# EAGLE design team6 (EAGLE 8.6.0)
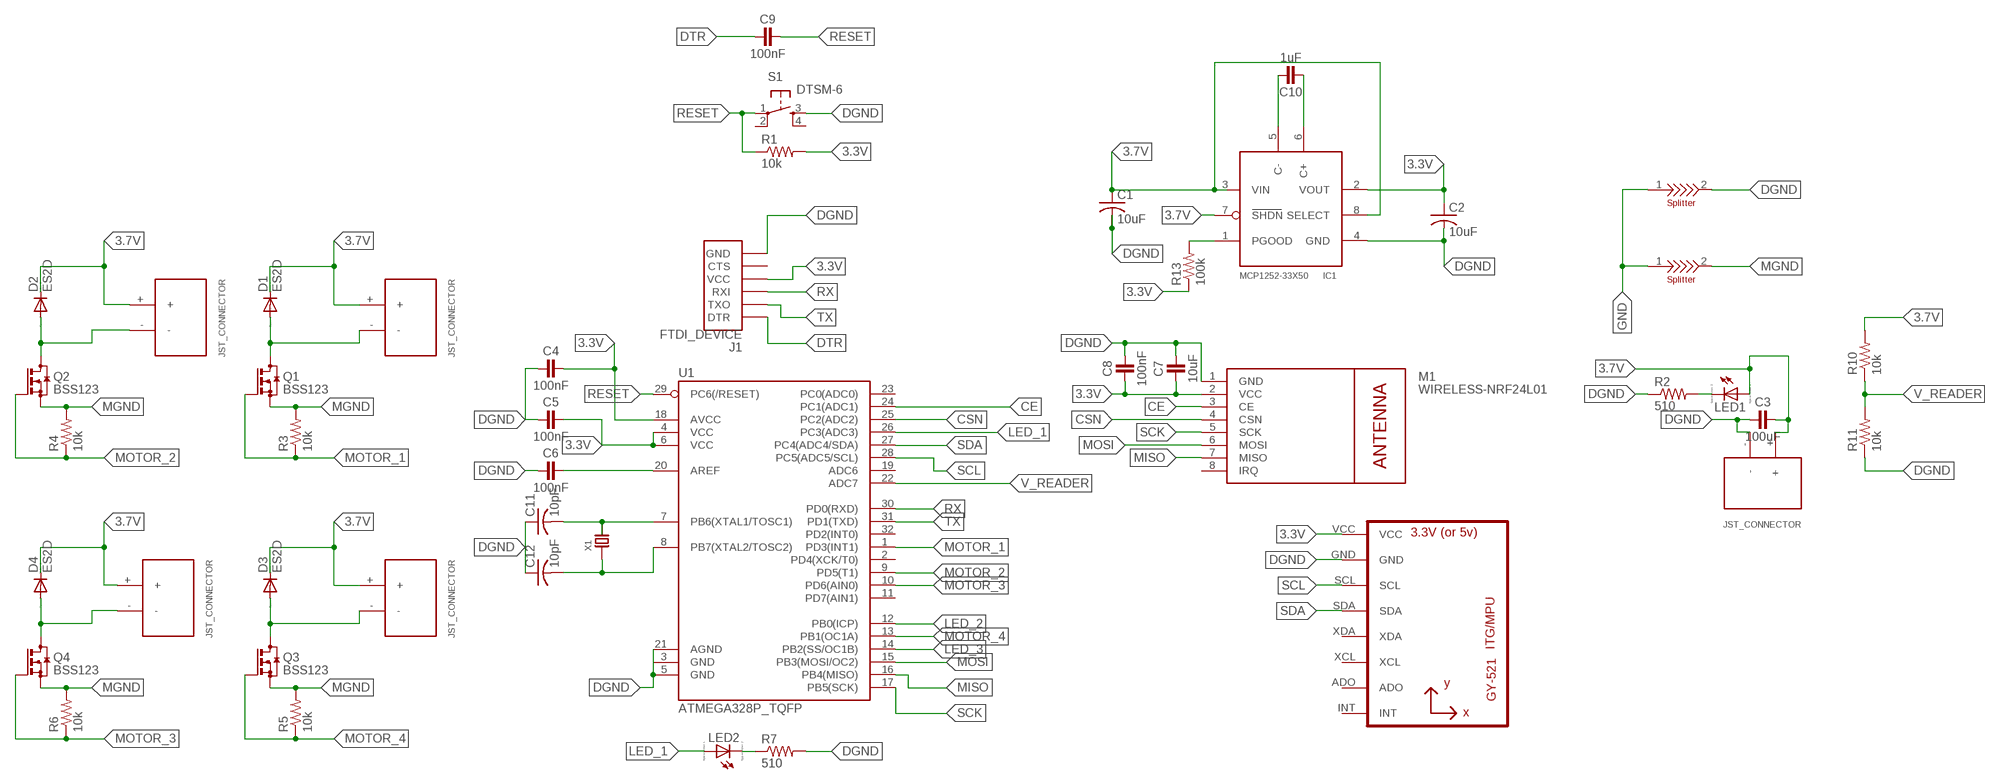
[diagram p0: schematic, sheet 1]

## Parts
C1  10uF  C-USC1206  [C1206]
C2  10uF  C-USC1206  [C1206]
C3  100uF  CAPACITOR-1206  [C1206]
C4  100nF  CAPACITOR-0603  [C0603]
C5  100nF  CAPACITOR-0603  [C0603]
C6  100nF  CAPACITOR-0603  [C0603]
C7  10uF  CAPACITOR-0603  [C0603]
C8  100nF  CAPACITOR-0603  [C0603]
C9  100nF  CAPACITOR-0603  [C0603]
C10  1uF  CAPACITOR-0603  [C0603]
C11  10pF  RCL_C-USC0603K  [RCL_C0603K]
C12  10pF  RCL_C-USC0603K  [RCL_C0603K]
D1  ES2D  [SMB]
D2  ES2D  [SMB]
D3  ES2D  [SMB]
D4  ES2D  [SMB]
IC1  MCP1252-33X50  [MSOP8]
J1  FTDI_DEVICE  [FTDI_DEVICE_SIDE]
JST_MOTOR_1  JST_MOTOR_1  JST_CONNECTOR_FEMALE  [JST_CONNECTOR_FEMALE]
LED1  LED_ESML0603  [LED_SML0603]
LED2  LED_ESML0603  [LED_SML0603]
M1  WIRELESS-NRF24L01  [WIRELESS-NRF24L01]
Q1  BSS123  [SOT23]
Q2  BSS123  [SOT23]
Q3  BSS123  [SOT23]
Q4  BSS123  [SOT23]
R1  10k  10.5KOHM1/10W1%(0603)  [0603]
R2  510  10.5KOHM1/10W1%(0603)  [0603]
R3  10k  10.5KOHM1/10W1%(0603)  [0603]
R4  10k  10.5KOHM1/10W1%(0603)  [0603]
R5  10k  10.5KOHM1/10W1%(0603)  [0603]
R6  10k  10.5KOHM1/10W1%(0603)  [0603]
R7  510  10.5KOHM1/10W1%(0603)  [0603]
R10  10k  10.5KOHM1/10W1%(0603)  [0603]
R11  10k  10.5KOHM1/10W1%(0603)  [0603]
R13  100k  10.5KOHM1/10W1%(0603)  [0603]
S1  DTSM-6  [DTSM-6]
U1  ATMEGA328P_TQFP  [TQFP32-08]
U3  GY-521MPU6050  [GY-521]
U$2  JST_CONNECTOR_FEMALE  [JST_CONNECTOR_FEMALE]
U$3  JST_CONNECTOR_FEMALE  [JST_CONNECTOR_FEMALE]
U$4  JST_CONNECTOR_FEMALE  [JST_CONNECTOR_FEMALE]
U$5  JST_CONNECTOR_FEMALE  [JST_CONNECTOR_FEMALE]
U$7  SPLITTER  [SPLITTER]
U$8  SPLITTER  [SPLITTER]
X1  CRYSTAL-NX3225GD  [NDK-NX3225GD]

## Nets
3.3V: C2.1 C4.2 C5.2 C7.1 C8.1 IC1.2(VOUT) J1.P$4(VCC) M1.2(VCC) R1.2 R13.1 U1.4(VCC) U1.6(VCC) U1.18(AVCC) U3.VCC
3.7V: C1.1 C3.2 D1.C D2.C D3.C D4.C IC1.3(VIN) IC1.7(SHDN) IC1.8(SELECT) JST_MOTOR_1.+ LED1.A R10.2 U$2.+ U$3.+ U$4.+ U$5.+
CE: M1.3(CE) U1.24(PC1(ADC1))
CSN: M1.4(CSN) U1.25(PC2(ADC2))
DGND: C1.2 C2.2 C3.1 C4.1 C5.1 C6.1 C7.2 C8.2 C11.1 C12.1 IC1.4(GND) J1.P$6(GND) M1.1(GND) R2.1 R7.2 R11.1 S1.3 U1.3(GND) U1.5(GND) U1.21(AGND) U3.GND U$2.- U$8.2
DTR: C9.1 J1.P$1(DTR)
GND: U$7.1 U$8.1
LED_1: LED2.A U1.26(PC3(ADC3))
LED_2: U1.12(PB0(ICP))
LED_3: U1.14(PB2(SS/OC1B))
MGND: Q1.2(S) Q2.2(S) Q3.2(S) Q4.2(S) R3.2 R4.2 R5.2 R6.2 U$7.2
MISO: M1.7(MISO) U1.16(PB4(MISO))
MOSI: M1.6(MOSI) U1.15(PB3(MOSI/OC2))
MOTOR_1: Q1.1(G) R3.1 U1.1(PD3(INT1))
MOTOR_2: Q2.1(G) R4.1 U1.9(PD5(T1))
MOTOR_3: Q4.1(G) R6.1 U1.10(PD6(AIN0))
MOTOR_4: Q3.1(G) R5.1 U1.13(PB1(OC1A))
N$1: D2.A Q2.3(D) U$3.-
N$2: D1.A JST_MOTOR_1.- Q1.3(D)
N$3: D3.A Q3.3(D) U$5.-
N$4: D4.A Q4.3(D) U$4.-
N$5: LED1.C R2.2
N$6: C11.2 U1.7(PB6(XTAL1/TOSC1)) X1.2
N$7: C12.2 U1.8(PB7(XTAL2/TOSC2)) X1.1
N$9: C6.2 U1.20(AREF)
N$11: C10.2 IC1.5(C-)
N$12: C10.1 IC1.6(C+)
N$16: LED2.C R7.1
PGOOD: IC1.1(PGOOD) R13.2
RESET: C9.2 R1.1 S1.1 U1.29(PC6(/RESET))
RX: J1.P$3(RXI) U1.30(PD0(RXD))
SCK: M1.5(SCK) U1.17(PB5(SCK))
SCL: U1.28(PC5(ADC5/SCL)) U3.SCL
SDA: U1.27(PC4(ADC4/SDA)) U3.SDA
TX: J1.P$2(TXO) U1.31(PD1(TXD))
V_READER: R10.1 R11.2 U1.22(ADC7)
Unconnected: J1.P$5(CTS) M1.8(IRQ) S1.2 S1.4 U1.2(PD4(XCK/T0)) U1.11(PD7(AIN1)) U1.19(ADC6) U1.23(PC0(ADC0)) U1.32(PD2(INT0)) U3.ADO U3.INT U3.XCL U3.XDA

## Library data of the parts
C1 C2 = resistor:C-US: CAPACITOR, American symbol
C3-C10 = we-rcl:CAPACITOR: Capacitors ...2.2uF @ 6.3V -> 0402 ...4.7uF @ 6.3V -> 0603 ...10uF @ 16V -> 0805 ...22uF @ 25V -> 1206
C11 C12 = OPS_Project_6_LIB:RCL_C-US: CAPACITOR, American symbol
D1-D4 = diode:ES2D: DIODE super fast rectifier, 2 A
IC1 = microchip-MCP125x-xxx:MCP1252-33X50: 650KHz 3.3V / 5.0V Selectable Switching Regulator
J1 = quad:FTDI_DEVICE: Connector which mates to FTDI basic or FTDI cable.
JST_MOTOR_1 U$2-U$5 = JST_CONNECTOR_FEMALE. through hole:JST_CONNECTOR_FEMALE
LED1 LED2 = eagle-ltspice:LED_E: LED Source: http://www.osram.convergy.de Source: www.luxeon.com Source: www.kingbright.com; SPICEMODEL: NONE; SPICEPREFIX: D; SPICETYPE: diode
M1 = quad:WIRELESS-NRF24L01: 2.4 GHz Wireless Module based on NRF24L01 chip
Q1-Q4 = transistor-small-signal:BSS123: N-CHANNEL MOS FET
R1-R7 R10 R11 R13 = SparkFun-Resistors:10.5KOHM1/10W1%(0603): RES-09570; PROD_ID: RES-09570; VALUE: 10.5k
S1 = switch-tact:DTSM-6
U1 = quad:ATMEGA328P_TQFP; PROD_ID: IC-09069
U3 = quad:GY-521
U$7 U$8 = splitter:SPLITTER
X1 = FaBo-Crystal:CRYSTAL

## Board
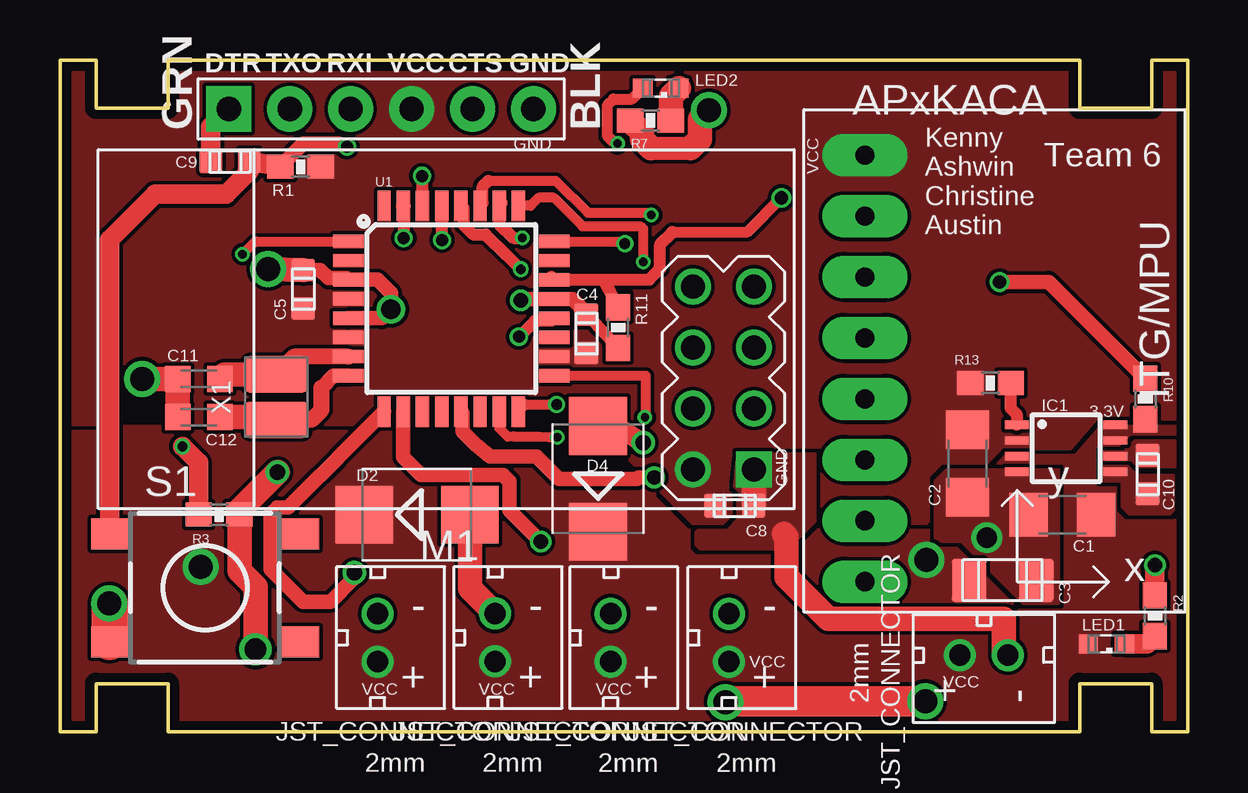
[diagram p1: board, top side]
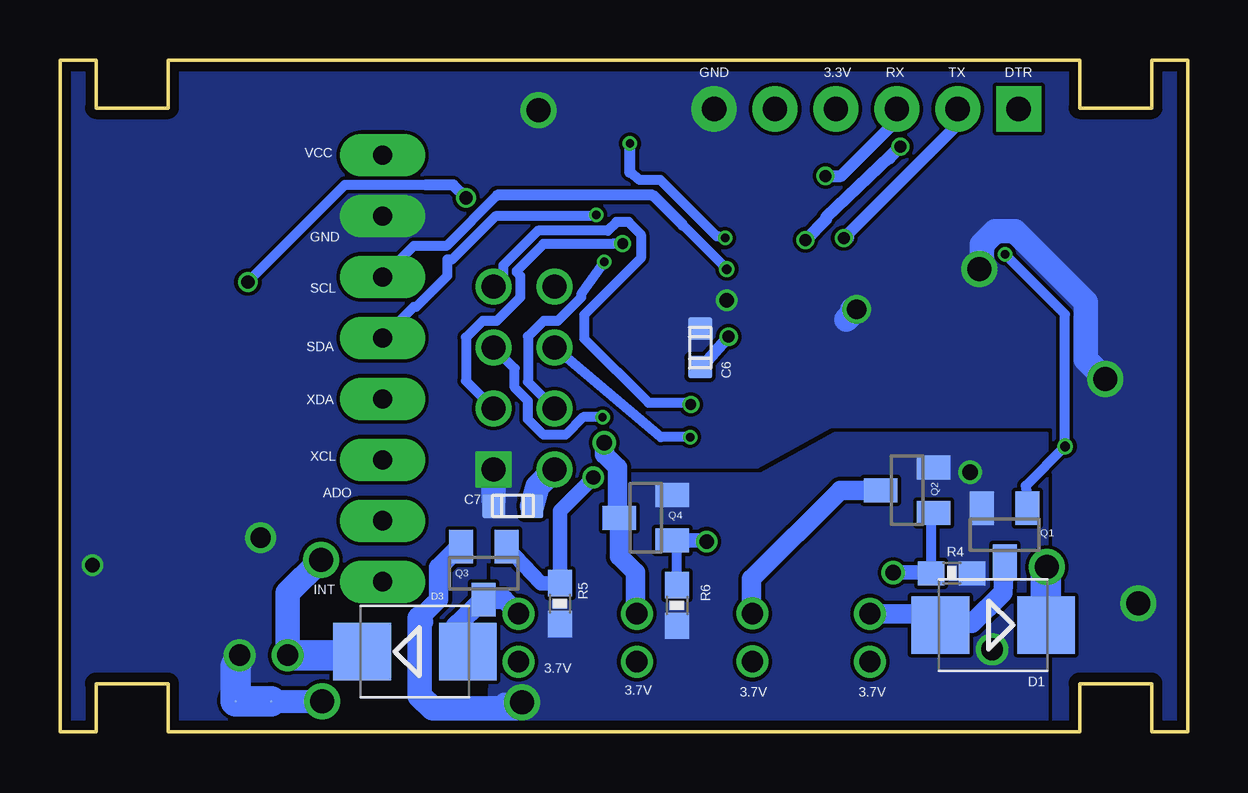
[diagram p2: board, bottom side, seen from below]

Size 47 x 28 mm. Coordinates in mm from the lower left corner, seen from the top.
Outline: 0,0 1.5,0 1.5,2 4.5,2 4.5,0 42.5,0 42.5,2 45.5,2 45.5,0 47,0 47,28 45.5,28 45.5,26 42.5,26 42.5,28 4.5,28 4.5,26 1.5,26 1.5,28 0,28 0,0
Copper layers (1*16): Top 0.035559375mm / dielectric 1.6mm / Bottom 0.035559375mm
Design rules "oshpark-2layer (2)": minimum track width 6mil, minimum drill 10mil, track to track 6mil, track to pad 6mil, pad to pad 6mil, via to via 6mil, smd to smd 6mil, copper to edge 15mil, drill to drill 6mil, minimum pad ring 5mil, minimum via ring 5mil, stop-mask expansion 2.5mil, vias tented up to drill 0mil, thermal gap 10mil

### Footprints (pad centres in the part's own frame; a part is rotated, then mirrored left to right if it is on the bottom)
C1206 = smd 1.6 x 1.8: 1 -1.4,0; 2 1.4,0
C1206' = smd 1.8 x 1.45: 1 0,1.4; 2 0,-1.4
C0603 = smd 1 x 0.95: 1 0,0.8; 2 0,-0.8
RCL_C0603K = smd 1.05 x 1.08: 1 -0.875,0; 2 0.875,0
SMB = smd 2.4 x 2.4: A 2.2,0; C -2.2,0
MSOP8 = smd 0.35 x 1: 1 -0.975,-2.05; 2 -0.325,-2.05; 3 0.325,-2.05; 4 0.975,-2.05; 5 0.975,2.05; 6 0.325,2.05; 7 -0.325,2.05; 8 -0.975,2.05
FTDI_DEVICE_SIDE = drill 1.016 pad 1.88 square: P$1 -6.35,0 | drill 1.016 pad 1.88: P$2 -3.81,0; P$3 -1.27,0; P$4 1.27,0; P$5 3.81,0; P$6 6.35,0
JST_CONNECTOR_FEMALE = drill 0.889: + 0,1; - 0,-1
LED_SML0603 = smd 0.8 x 0.8: A 0.75,0; C -0.75,0
WIRELESS-NRF24L01 = drill 1 square: 1 -12.7,6.35 | drill 1: 2 -10.16,6.35; 3 -12.7,3.81; 4 -10.16,3.81; 5 -12.7,1.27; 6 -10.16,1.27; 7 -12.7,-1.27; 8 -10.16,-1.27
SOT23 = smd 1 x 1.4: 1 -0.95,-1.1; 2 0.95,-1.1; 3 0,1.1
0603 = smd 1.1 x 1: 1 -0.85,0; 2 0.85,0
DTSM-6 = smd 1.55 x 1.3: 1 -3.975,2.25; 2 3.975,2.25; 3 -3.975,-2.25; 4 3.975,-2.25
TQFP32-08 = smd 1.27 x 0.559: 1 -4.293,2.8; 2 -4.293,2; 3 -4.293,1.2; 4 -4.293,0.4; 5 -4.293,-0.4; 6 -4.293,-1.2; 7 -4.293,-2; 8 -4.293,-2.8; 17 4.293,-2.8; 18 4.293,-2; 19 4.293,-1.2; 20 4.293,-0.4; 21 4.293,0.4; 22 4.293,1.2; 23 4.293,2; 24 4.293,2.8 | smd 0.559 x 1.27: 9 -2.8,-4.293; 10 -2,-4.293; 11 -1.2,-4.293; 12 -0.4,-4.293; 13 0.4,-4.293; 14 1.2,-4.293; 15 2,-4.293; 16 2.8,-4.293; 25 2.8,4.293; 26 2,4.293; 27 1.2,4.293; 28 0.4,4.293; 29 -0.4,4.293; 30 -1.2,4.293; 31 -2,4.293; 32 -2.8,4.293
GY-521 = drill 0.8 pad 1.778 long: ADO -8.89,-6.35; GND -8.89,6.35; INT -8.89,-8.89; SCL -8.89,3.81; SDA -8.89,1.27; VCC -8.89,8.89; XCL -8.89,-3.81; XDA -8.89,-1.27
SPLITTER = smd 0.102 x 0.102: 1 0,0; 2 0,0
NDK-NX3225GD = smd 1.5 x 2.7: 1 -0.95,0; 2 0.95,0

### Placement (x,y rotation side)
C1  41.78,9.04 180 top
C2  37.82,11.18 270 top
C3  100uF  [C1206']  39.29,6.3 270 top
C4  21.95,16.59 0 top
C5  10.13,18.44 0 top
C6  20.32,16 0 bottom
C7  28.12,9.4 270 bottom
C8  28.12,9.42 90 top
C9  7.09,23.77 90 top
C10  45.34,10.72 0 top
C11  5.79,14.71 0 top
C12  5.79,13.11 0 top
D1  8.1,4.45 180 bottom
D2  14.88,9.04 0 top
D3  32.21,3.33 0 bottom
D4  22.43,10.54 90 top
IC1  41.94,11.81 270 top
J1  13.39,25.96 0 top
JST_MOTOR_1  13.24,3.92 180 top
LED1  43.61,3.66 180 top
LED2  25.04,26.82 180 top
M1  16.23,17.28 180 top
Q1  7.62,8.2 180 bottom
Q2  11.68,10.06 90 bottom
Q3  29.34,6.6 180 bottom
Q4  22.58,8.92 90 bottom
R1  10.03,23.55 0 top
R2  45.64,4.83 270 top
R3  6.63,9.04 0 top
R4  9.83,6.6 0 bottom
R5  26.16,5.33 270 bottom
R6  21.29,5.26 270 bottom
R7  24.61,25.48 180 top
R10  45.24,13.87 270 top
R11  23.27,16.84 90 top
R13  38.79,14.53 0 top
S1  6.05,5.99 0 top
U1  16.31,17.63 0 top
U3  42.44,15.14 0 top
U$2  38.51,3.18 90 top
U$3  18.13,3.92 180 top
U$4  22.96,3.91 180 top
U$5  27.89,3.91 180 top
U$7  38.2,1.27 0 bottom
U$8  39.67,1.27 0 bottom
X1  9.02,13.94 90 top

### Tracks (layer width: path | path; a pad name or v marks a point on that pad's centre or on a via)
3.3V
  Bottom 1.016: C7.1 27.09,10.23 M1.2
  pour Top (rank 4, no thermals): 0.53,27.74 0.53,12.8 22.25,12.8 26.37,8.69 36.12,8.69 39.24,11.81 42.14,11.81 43.21,13.03 46.86,13.03 46.86,27.74
3.7V  (via drill 1)
  Bottom 1.016: v36.12,7.16 37.51,5.77 U$2.+
  Bottom 1.27: D3.C 35.33,3.18 U$2.+ | D1.C 5.9,6.82 v5.87,6.86
  pour Top (rank 6, no thermals): 0.53,12.73 46.79,12.73 46.94,-1.68 0.53,-1.3
CE  (via drill 0.45)
  Top 0.406: v23.55,20.34 23.46,20.43 U1.24
  Bottom 0.406: v23.55,20.34 23.92,20.34 23.94,20.32 26.84,20.32 27.96,19.2 27.96,19.16 27.82,19.01 27.82,18.09 28.8,17.12 29.38,17.12 30.07,16.43 30.07,14.62 M1.3
CSN  (via drill 0.35)
  Top 0.406: U1.25 19.62,21.93 19.95,22.26 20.59,22.26 21.77,21.07 24.19,21.07 24.31,20.95 v24.31,19.59
  Bottom 0.406: M1.4 27.49,14.58 27.49,16.47 26.84,17.12 26.26,17.12 25.28,18.09 25.28,18.24 v24.31,19.59
DGND  (via drill 0.6, 0.8, 0.85, 1)
  Top 0.508: C4.1 22.25,17.08 R11.1
  Top 0.61: U1.5 13.42,17.23 v13.79,17.6 13.79,18.29 13.25,18.83 U1.3 11.95,18.9 11.19,18.9 10.85,19.24 C5.1 | v19.2,17.98 19.13,17.98 19.18,18.03 U1.21 21.37,18.03 21.37,18.02 21.7,17.7 21.7,17.64 C4.1
  Top 0.813: R2.1 v45.64,6.93
  Top 0.965: 24.64,24.32 26.29,24.32
  Top 1.016: v8.69,19.28 C5.1 | C8.2 28.92,10.33 M1.1 | 30.18,8.23 30.28,8.12 30.28,6.44 32.02,4.7 39.34,4.7 39.34,3.35 U$2.- | 24.64,24.32 24.25,24.7 24.25,24.99 R7.2 | 26.29,24.32 26.67,24.7 26.67,25.53 v27.05,25.91 | C12.1 C11.1 v3.43,14.71
  Top 1.524: S1.3 v2.07,5.32 v2.06,5.33
  Bottom 0.61: C7.2 28.93,9.63
  Bottom 1.016: 14.22,17.17 v13.79,17.6 13.97,17.6 | 28.93,9.63 M1.1 | v3.43,14.71 4.24,15.52 4.24,17.9 7.21,20.86 8.01,20.86 8.57,20.3 8.57,19.4 v8.69,19.28
  Bottom 1.27: U$8.2 39.67,2.71 U$2.-
  other vias: 38.63,8.08
  pour Bottom (rank 6, no thermals): 0.46,27.66 0.46,0.3 46.71,0.3 46.71,27.66
  pour Top (no thermals): 36.5,10.36 36.5,8 36.58,7.92 37.57,7.92 40.16,5.33 41.61,5.33 41.61,10.9 36.96,10.9 36.5,10.44
  pour Top (no thermals): 28.42,9.83 28.27,9.68 28.27,8.84 27.81,8.38 26.59,8.38 26.52,8.31 26.52,7.77 26.67,7.62 30.33,7.62 31.47,8.76 31.47,11.58 28.27,11.58 28.12,10.21 28.42,9.91
DTR
  Top 0.813: J1.P$1 6.29,25.21 C9.1
GND
  Bottom 1.27: U$8.1 U$7.1
LED_1  (via drill 0.35)
  Top 0.457: LED2.A 23.84,26.36 23.06,26.36 22.83,26.13 22.83,24.82 23.05,24.59 23.24,24.59 v23.24,24.51
  Top 0.508: 18.42,22.04 U1.26 18.31,21.16 18.9,20.58 v19.28,20.58
  Bottom 0.406: v19.28,20.58 19.64,20.65 21.97,22.99 22.84,22.99 23.24,23.32
  Bottom 0.457: 23.24,23.32 v23.24,24.51
MGND  (via drill 0.65, 0.9, 1)
  Top 1.016: v8.15,3.43 8.15,6.03 7.48,6.7 R3.2 7.48,9.23 v9.07,10.82
  Top 1.27: v36.07,1.27 27.79,1.27 v27.74,1.22
  Bottom 0.813: 28.65,1.03 28.47,1.22 v27.74,1.22 | 31.84,4.56 32,4.72 31.22,5.51 31.22,6.85 30.36,7.7 Q3.2
  Bottom 0.965: U$7.2 v36.07,1.27
  Bottom 1.016: v27.74,1.22 27.99,0.96 31.47,0.96 32,1.5 32,4.72
  pour Bottom (no thermals): 5.87,12.42 14.71,12.42 17.75,10.74 27.66,10.74 28.96,8.38 29.11,0.3 27.51,0.23 5.87,0.23
MISO  (via drill 0.45)
  Top 0.406: U1.16 19.41,13.64 v20.71,13.64 20.42,13.64
  Bottom 0.406: M1.7 28.93,18.44 28.52,18.84 28.52,19.43 27.08,20.88 24.17,20.88 23.81,21.24 23.3,21.24 22.78,20.73 22.78,19.74 25.15,17.37 25.15,16.38 22.48,13.72 20.78,13.72 v20.71,13.64
MOSI  (via drill 0.35)
  Top 0.406: U1.15 18.31,12.65 18.66,12.3 | 18.66,12.3 | 18.66,12.3 18.91,12.32 18.93,12.3 19.97,12.3 20.37,12.28 v20.74,12.28
  Bottom 0.406: v20.74,12.28 21.97,12.28 M1.6
MOTOR_1  (via drill 0.35, 0.41)
  Top 0.406: v7.61,19.9 8.14,20.43 U1.1
  Top 0.813: R3.1 5.78,11.21 v5.11,11.89
  Bottom 0.406: Q1.1 6.75,10.25 v5.11,11.89 5.11,17.4 v7.61,19.9
MOTOR_2  (via drill 0.65)
  Top 0.61: U1.9 11.57,11.4 11.57,11.39 10.86,10.68 10.85,10.68 9.52,9.35 9.06,9.35 8.79,9.08 8.79,6.76 10.13,5.41 11.28,5.41 12.27,6.4 v12.27,6.63
  Bottom 0.406: R4.1 10.68,9.01 Q2.1
  Bottom 0.61: v12.27,6.63 10.71,6.63 R4.1
MOTOR_3  (via drill 0.6)
  Top 0.61: U1.10 14.31,11.45 15.06,10.7 18.47,10.7 18.74,10.43 18.74,9.22 v20.04,7.92
  Bottom 0.406: R6.1 21.29,7.76 21.42,7.9
  Bottom 0.61: Q4.1 20.08,7.96 v20.04,7.92
  Bottom 0.813: 21.42,7.9 Q4.1
MOTOR_4  (via drill 0.6)
  Top 0.61: U1.13 16.77,13.28 16.77,12.52 17.32,11.97 17.93,11.46 19.87,11.46 20.81,10.53 24.05,10.53 24.12,10.59 v24.77,10.59
  Bottom 0.61: Q3.1 26.94,6.18 R5.1 26.16,9.2 v24.77,10.59
N$1
  Top 1.016: U$3.- 17.08,5.97 D2.A
  Bottom 0.813: Q2.3 14.47,10.06 18.17,6.36 18.17,4.95 U$3.-
N$2
  Bottom 0.813: JST_MOTOR_1.- 10.77,4.92 10.36,4.5 | 10.36,4.5 D1.A | 10.36,4.5 8.99,4.5 7.7,5.79 Q1.3
N$3
  Bottom 0.813: U$5.- 28.48,5.5 Q3.3 30.54,4.38 D3.A
N$4  (via drill 0.65)
  Top 0.813: v24.31,12.04 23.18,12.74 D4.A
  Bottom 0.813: v24.31,12.04 24.31,11.56 23.76,11.01 23.76,8.99 Q4.3 23.68,7.3 23.01,6.63 23.01,4.97 U$4.-
N$5
  Top 0.813: LED1.C 45.33,3.66 R2.2
N$6
  Top 0.66: U1.7 9.76,15.63 X1.2
  Top 1.016: C11.2 6.85,14.89 X1.2
N$7
  Top 0.61: 10.9,14.33 11.4,14.83 U1.8
  Top 0.66: 10.9,14.33 10.9,13.41 10.48,12.99 10.18,12.99
  Top 0.711: 10.18,12.99 X1.1
  Top 1.016: C12.2 8.9,13.11 X1.1
N$9  (via drill 0.5)
  Top 0.508: U1.20 20.49,17.12 19.8,17.12 19.13,16.45 v19.13,16.46
  Bottom 0.508: v19.13,16.46 20.28,15.16 C6.2
N$11
  pour Top (no thermals): 43.43,11.05 44.5,11.05 44.88,10.67 46.41,10.67 46.41,9.22 46.25,9.07 44.58,9.07 44.27,9.37 44.27,10.44 43.43,10.44
N$12
  pour Top (no thermals): 43.43,11.66 44.35,11.66 44.81,12.12 46.48,12.12 46.48,11.05 44.96,11.05 44.65,11.35 43.43,11.35
N$16
  Top 1.016: R7.1 25.46,26.49 LED2.C
PGOOD
  Top 0.508: R13.2 39.62,14.52 39.62,13.49 39.88,13.23 IC1.1
RESET  (via drill 0.5)
  Top 0.508: U1.29 15.91,20.51 v15.93,20.5 | v11.96,24.38 11.84,24.5 11.62,24.5
  Top 0.61: R1.1 10.14,24.5 11.62,24.5
  Top 0.813: S1.1 2.07,20.51 3.96,22.4 6.93,22.4 7.89,23.36 C9.2 R1.1
  Bottom 0.508: v15.93,20.5 15.07,21.36 15.07,21.43 v11.96,24.38 12.42,23.91
RX  (via drill 0.5)
  Top 0.508: U1.30 15.11,23.14 v15.09,23.16
  Bottom 0.508: J1.P$3 12.12,25.49 14.44,23.16 v15.09,23.16
SCK  (via drill 0.35)
  Top 0.406: U1.17 24.42,14.83 24.42,13.14 v24.38,13.11
  Bottom 0.406: M1.5 28.05,15.14 28.05,14.35 27.49,13.79 27.49,13.01 26.84,12.37 25.93,12.37 25.19,13.11 v24.38,13.11
SCL  (via drill 0.4)
  Top 0.406: U1.28
  Top 0.508: U1.28 16.82,21.81 16.82,21.12 17.22,20.73 17.75,20.73 18.6,19.87 18.61,19.87 v19.2,19.28
  Bottom 0.406: U3.SCL 32.26,20.24 30.89,20.24 28.77,22.36 | v19.2,19.28 21.04,21.11
  Bottom 0.457: 21.04,21.11 22.28,22.36 28.77,22.36
SDA  (via drill 0.35)
  Top 0.406: 17.86,22.97 20.67,22.97 22.01,21.63 24.57,21.63 v24.65,21.54
  Top 0.508: 17.86,22.97 17.62,22.73 17.62,22.04 U1.27
  Bottom 0.406: 32.63,16.41 U3.SDA 32.26,17.7 32.15,17.7 30.86,18.99 30.86,19.68 30.66,19.68 28.85,21.49 24.7,21.49 v24.65,21.54
TX  (via drill 0.5)
  Top 0.508: 14.33,21.91 v14.33,20.57
  Top 0.61: 14.33,21.91 U1.31
  Bottom 0.508: 14.25,20.5 v14.33,20.57 | v14.33,20.57 14.15,20.57 | 9.58,25.32 v14.33,20.57
  Bottom 0.61: J1.P$2 9.58,25.32
V_READER  (via drill 0.55)
  Top 0.457: 25.53,20.83 28.65,20.83 v30.07,22.25
  Top 0.508: 20.49,18.95 U1.22 22.66,18.83 | 22.66,18.83 R11.2 | 25.53,20.83 25.02,20.32 25.02,19.3 24.55,18.83 22.66,18.83
  Top 0.61: v39.17,18.75 41.21,18.75 R10.1
  Bottom 0.406: v39.17,18.75 35.13,22.78 31.75,22.78
  Bottom 0.457: v30.07,22.25 30.61,22.78 31.75,22.78

### Text on the board
tPlace: APxKACA | GND | Team 6 | VCC | Kenny / Ashwin / Christine / Austin | 3.3V | GND | VCC | VCC | VCC | VCC | VCC
bPlace: DTR | TX | RX | 3.3V | GND | VCC | GND | SCL | SDA | XDA | XCL | ADO | INT | 3.7V | 3.7V | 3.7V | 3.7V